# Altium schematic sheet switch.SchDoc
size A4; SheetNumber: 3; SheetTotal: 3
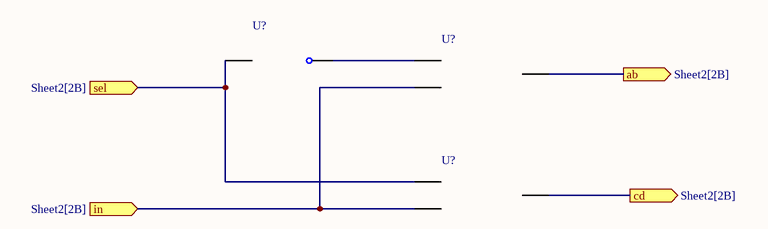
[diagram p0: switch.SchDoc]

## Parts
(Parts that share a designator on the sheet are numbered #1, #2 ... from top to bottom, then left to right.)
U?#1  Digital NOT Gate  (value not drawn)
U?#2  Digital AND Gate  (value not drawn)
U?#3  Digital AND Gate  (value not drawn)

## Ports
ab (out, see Sheet2[2B]), cd (out, see Sheet2[2B]), in (in, see Sheet2[2B]), sel (in, see Sheet2[2B])

## Nets
ab: U?#2.3 ; port ab
cd: U?#3.3 ; port cd
in: U?#2.2 U?#3.2 ; port in
sel: U?#1.1 U?#3.1 ; port sel
NetU?#1_2: U?#1.2 U?#2.1

## Library data of the parts
U?#1 = Digital NOT: rise_delay_inst: 1n; input_load_inst: 1p; SimulationGenericComponent: True; fall_delay_inst: 1n
U?#2 U?#3 = Digital AND: rise_delay_inst: 1n; input_load_inst: 1p; SimulationGenericComponent: True; fall_delay_inst: 1n